# Altium schematic sheet LCA_V2.SchDoc
size 420 x 297 mm; SheetNumber: 1; SheetTotal: 3
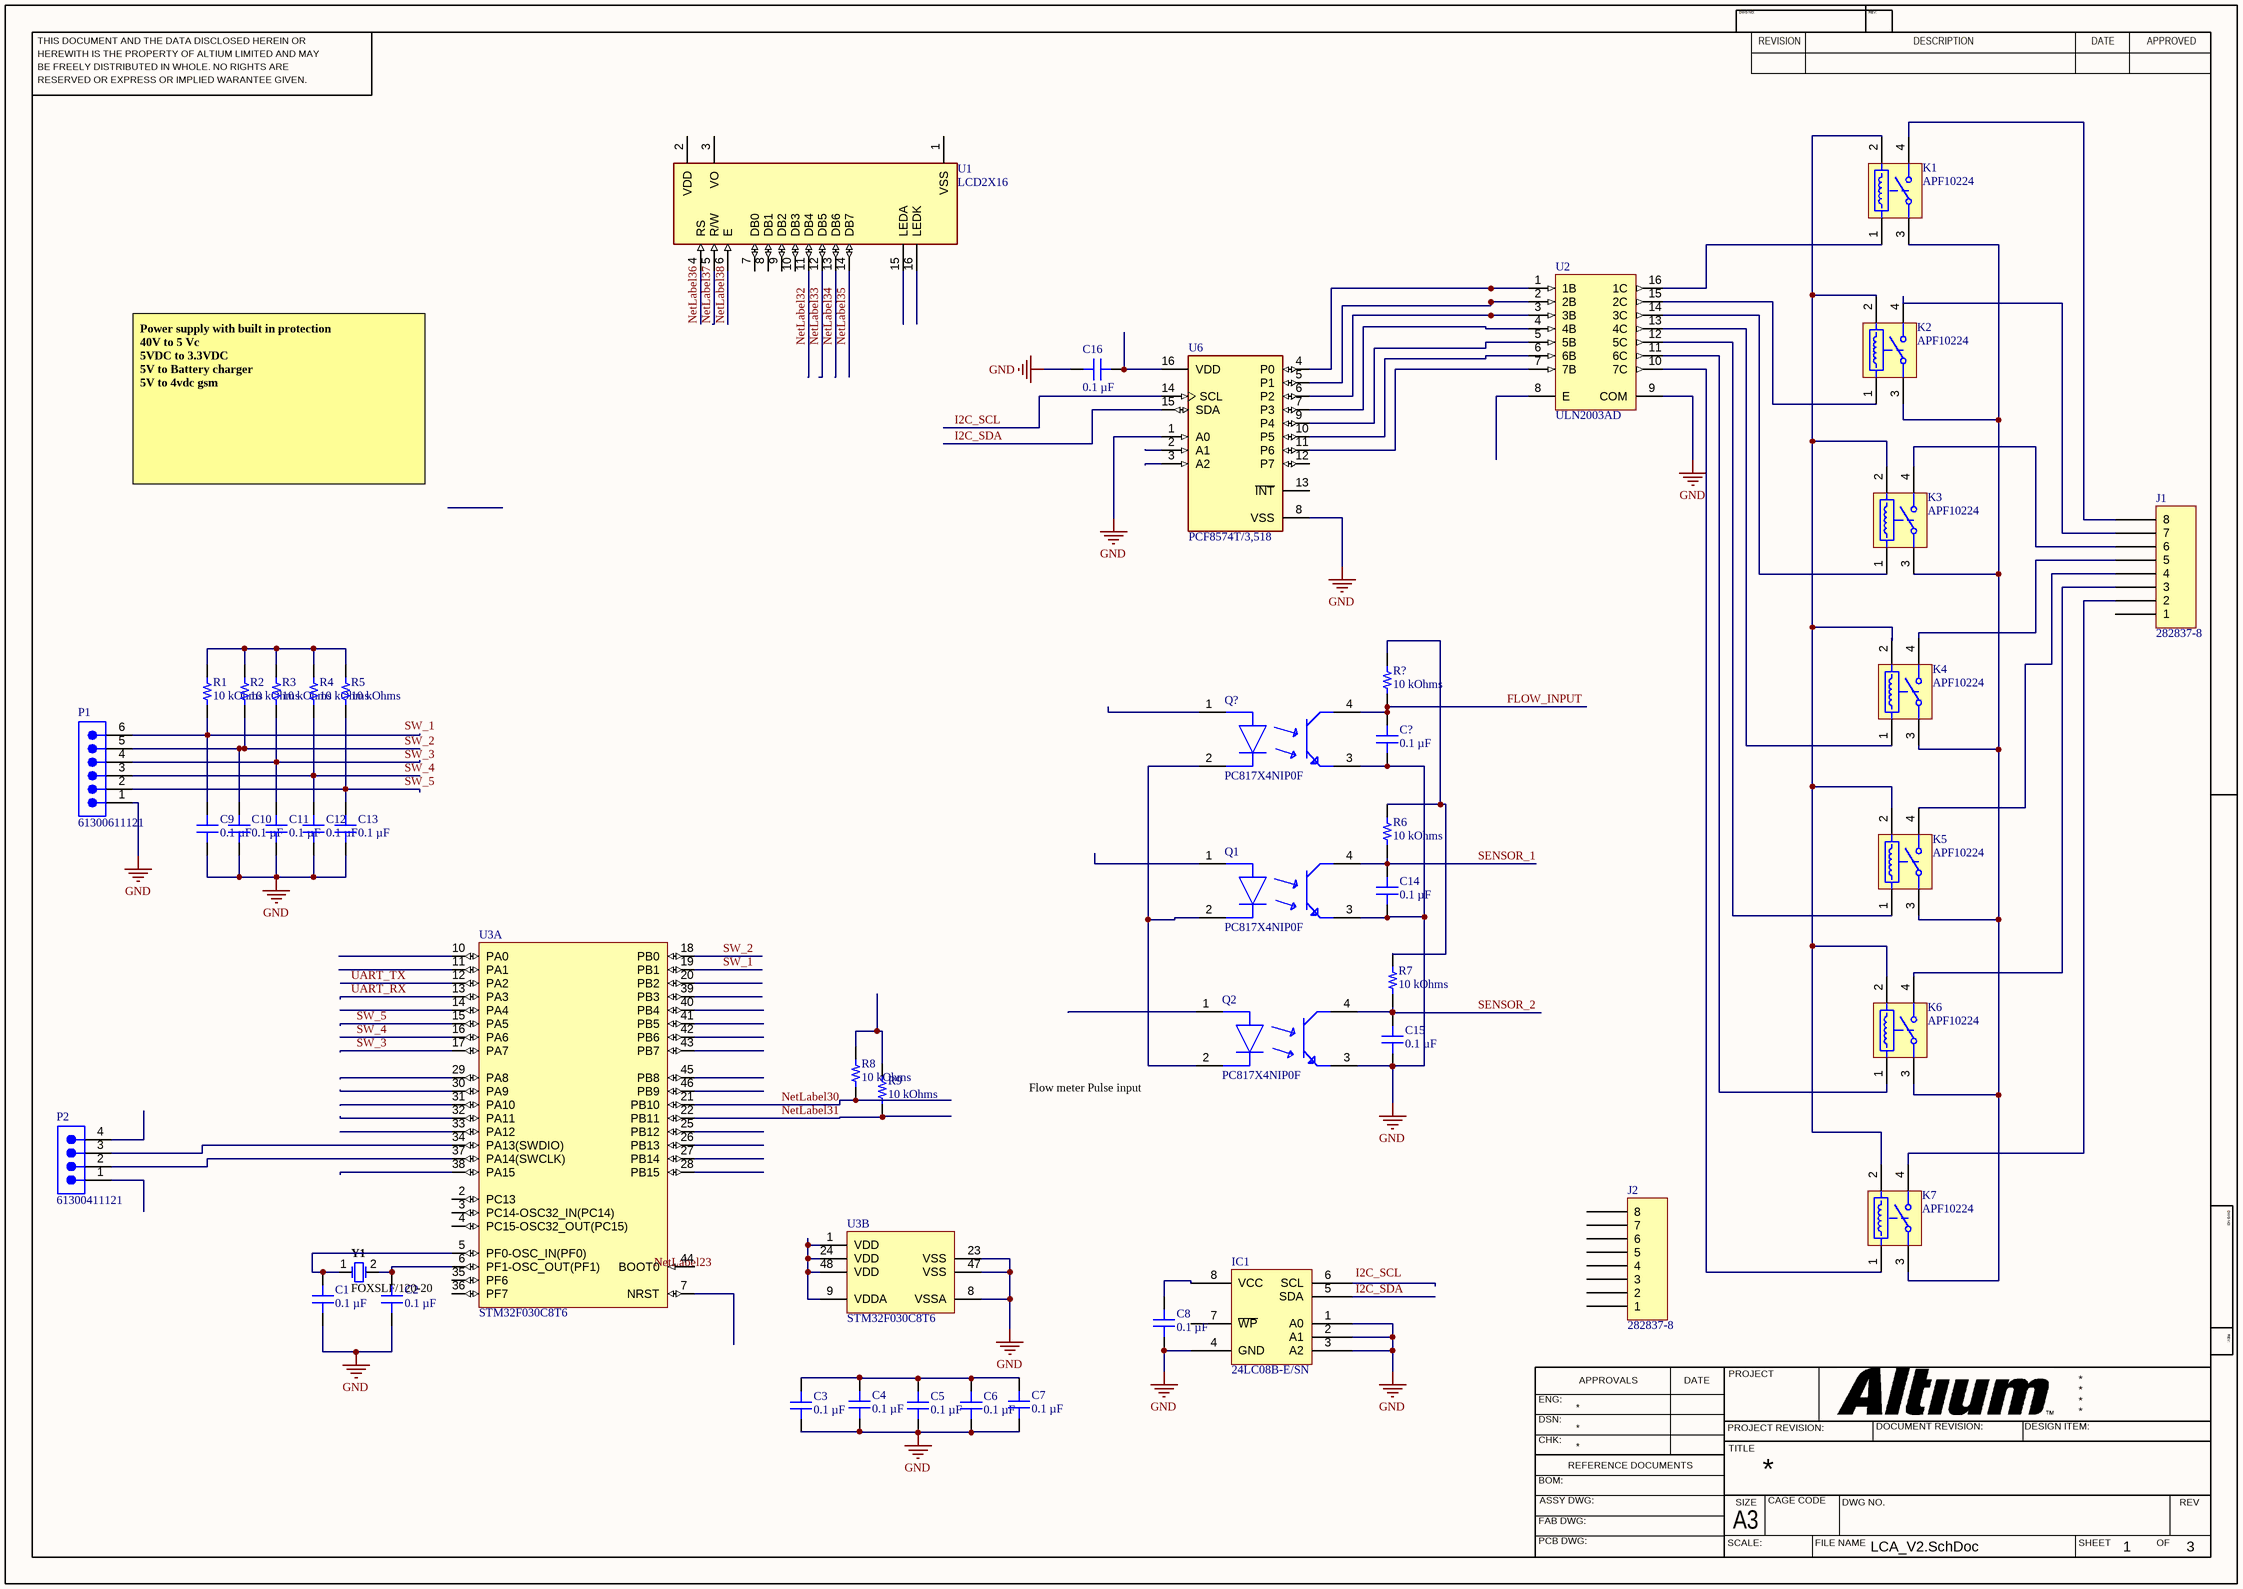
[diagram p0: LCA_V2.SchDoc]

## Parts
C1  0.1 µF  [CAP 0603_1608]
C2  0.1 µF  [CAP 0603_1608]
C3  0.1 µF  [CAP 0603_1608]
C4  0.1 µF  [CAP 0603_1608]
C5  0.1 µF  [CAP 0603_1608]
C6  0.1 µF  [CAP 0603_1608]
C7  0.1 µF  [CAP 0603_1608]
C8  0.1 µF  [CAP 0603_1608]
C9  0.1 µF  [CAP 0603_1608]
C10  0.1 µF  [CAP 0603_1608]
C11  0.1 µF  [CAP 0603_1608]
C12  0.1 µF  [CAP 0603_1608]
C13  0.1 µF  [CAP 0603_1608]
C14  0.1 µF  [CAP 0603_1608]
C15  0.1 µF  [CAP 0603_1608]
C16  0.1 µF  [CAP 0603_1608]
C?  0.1 µF  [CAP 0603_1608]
IC1  24LC08B-E/SN  [MICROCHIP SOIC-8 150MIL WIDE]
J1  282837-8  [TE 282837-8]
J2  282837-8  [TE 282837-8]
K1  APF10224  [PNSC-PF-4-2800x500x1500_V]
K2  APF10224  [PNSC-PF-4-2800x500x1500_V]
K3  APF10224  [PNSC-PF-4-2800x500x1500_V]
K4  APF10224  [PNSC-PF-4-2800x500x1500_V]
K5  APF10224  [PNSC-PF-4-2800x500x1500_V]
K6  APF10224  [PNSC-PF-4-2800x500x1500_V]
K7  APF10224  [PNSC-PF-4-2800x500x1500_V]
P1  61300611121  [61300611121]
P2  61300411121  [61300411121]
Q1  PC817X4NIP0F  [FP-PC817X4NIP0F-MFG]
Q2  PC817X4NIP0F  [FP-PC817X4NIP0F-MFG]
Q?  PC817X4NIP0F  [FP-PC817X4NIP0F-MFG]
R1  10 kOhms  [RES 0603_1608]
R2  10 kOhms  [RES 0603_1608]
R3  10 kOhms  [RES 0603_1608]
R4  10 kOhms  [RES 0603_1608]
R5  10 kOhms  [RES 0603_1608]
R6  10 kOhms  [RES 0603_1608]
R7  10 kOhms  [RES 0603_1608]
R8  10 kOhms  [RES 0603_1608]
R9  10 kOhms  [RES 0603_1608]
R?  10 kOhms  [RES 0603_1608]
U1  LCD2X16  [LCD_LCD2X16]
U2  ULN2003AD  [D0016A_M]
U3  STM32F030C8T6  [STM-LQFP48_L]  (parts A,B of 2)
U6  PCF8574T/3,518  [FP-SOT162-1-MFG]
Y1  FOXSLF/120-20  [FOX-FOXSLF-2_V]

## Nets
GND: C1.1 C2.1 C3.1 C4.1 C5.1 C6.1 C7.1 C8.1 C9.1 C10.1 C11.1 C12.1 C13.1 C14.1 C15.1 C16.2 C?.1 IC1.1(A0) IC1.2(A1) IC1.3(A2) IC1.4(GND) P1.1 Q1.3(E) Q2.3(E) Q?.3(E) U2.9(COM) U3.8(VSSA) U3.23(VSS) U3.47(VSS) U6.1(A0) U6.8(VSS)
FLOW_INPUT: C?.2 Q?.4(C) R?.1
I2C_SCL: U6.14(SCL)
I2C_SDA: IC1.5(SDA) U6.15(SDA)
NetLabel30: R8.1 U3.21(PB10)
NetLabel31: R9.1 U3.22(PB11)
NetLabel32: U1.11(DB4)
NetLabel33: U1.12(DB5)
NetLabel34: U1.13(DB6)
NetLabel35: U1.14(DB7)
NetLabel36: U1.4(RS)
NetLabel37: U1.5(R/W)
NetLabel38: U1.6(E)
SENSOR_1: C14.2 Q1.4(C) R6.1
SENSOR_2: C15.2 Q2.4(C) R7.1
SW_1: U3.19(PB1)
SW_2: C10.2 P1.5 R2.1 U3.18(PB0)
SW_3: C11.2 P1.4 R3.1 U3.17(PA7)
SW_4: C12.2 P1.3 R4.1 U3.16(PA6)
SW_5: C13.2 P1.2 R5.1 U3.15(PA5)
UART_RX: U3.13(PA3)
UART_TX: U3.12(PA2)
NetC1_2: C1.2 U3.5(PF0-OSC_IN(PF0)) Y1.1
NetC2_2: C2.2 U3.6(PF1-OSC_OUT(PF1)) Y1.2
NetC3_2: C3.2 C4.2 C5.2 C6.2 C7.2
NetC8_2: C8.2 IC1.8(VCC)
NetC9_2: C9.2 P1.6 R1.1
NetC16_1: C16.1 U6.16(VDD)
NetJ1_2: J1.2 K7.4(NO)
NetJ1_3: J1.3 K6.4(NO)
NetJ1_4: J1.4 K5.4(NO)
NetJ1_5: J1.5 K4.4(NO)
NetJ1_6: J1.6 K3.4(NO)
NetJ1_7: J1.7 K2.4(NO)
NetJ1_8: J1.8 K1.4(NO)
NetK1_1: K1.1 U2.16(1C)
NetK1_2: K1.2 K2.2 K3.2 K4.2 K5.2 K6.2 K7.2
NetK1_3: K1.3(COM) K2.3(COM) K3.3(COM) K4.3(COM) K5.3(COM) K6.3(COM) K7.3(COM)
NetK2_1: K2.1 U2.15(2C)
NetK3_1: K3.1 U2.14(3C)
NetK4_1: K4.1 U2.13(4C)
NetK5_1: K5.1 U2.12(5C)
NetK6_1: K6.1 U2.11(6C)
NetK7_1: K7.1 U2.10(7C)
NetP2_2: P2.2 U3.37(PA14(SWCLK))
NetP2_3: P2.3 U3.34(PA13(SWDIO))
NetQ1_2: Q1.2(C) Q2.2(C) Q?.2(C)
NetR1_2: R1.2 R2.2 R3.2 R4.2 R5.2
NetR6_2: R6.2 R7.2 R?.2
NetR8_2: R8.2 R9.2
NetU2_1: U2.1(1B) U6.4(P0)
NetU2_2: U2.2(2B) U6.5(P1)
NetU2_3: U2.3(3B) U6.6(P2)
NetU2_4: U2.4(4B) U6.7(P3)
NetU2_5: U2.5(5B) U6.9(P4)
NetU2_6: U2.6(6B) U6.10(P5)
NetU2_7: U2.7(7B) U6.11(P6)
NetU3_1: U3.1(VDD) U3.9(VDDA) U3.24(VDD) U3.48(VDD)

Not connected (* = marked no-connect by the designer): IC1 6(SCL) 7(~{WP}); J1 1; J2 1 2 3 4 5 6 7 8; P2 1 4; Q1 1(A); Q2 1(A); Q? 1(A); U1 1(VSS) 2(VDD) 3(VO) 7(DB0) 8(DB1) 9(DB2) 10(DB3) 15(LEDA) 16(LEDK); U2 8(E); U3 2(PC13) 3(PC14-OSC32_IN(PC14)) 4(PC15-OSC32_OUT(PC15)) 7(NRST) 10(PA0) 11(PA1) 14(PA4) 20(PB2) 25(PB12) 26(PB13) 27(PB14) 28(PB15) 29(PA8) 30(PA9) 31(PA10) 32(PA11) 33(PA12) 35(PF6) 36(PF7) 38(PA15) 39(PB3) 40(PB4) 41(PB5) 42(PB6) 43(PB7) 44(BOOT0) 45(PB8) 46(PB9); U6 2(A1) 3(A2) 12(P7) 13(~{INT})

## Notes on the sheet
- Power supply with built in protection
  40V to 5 Vc
  5VDC to 3.3VDC
  5V to Battery charger
  5V to 4vdc gsm
- (near Q2) Flow meter Pulse input
- Labels drawn without touching a wire or pin: I2C_SCL, NetLabel23, SW_1
- THIS DOCUMENT AND THE DATA DISCLOSED HEREIN OR
- HEREWITH IS THE PROPERTY OF ALTIUM LIMITED AND MAY
- DWG NO:
- REVISION
- REV:
- DESCRIPTION
- DATE
- APPROVED
- BE FREELY DISTRIBUTED IN WHOLE. NO RIGHTS ARE
- RESERVED OR EXPRESS OR IMPLIED WARANTEE GIVEN.
- ENG:
- APPROVALS
- PROJECT
- DSN:
- CHK:
- REFERENCE DOCUMENTS
- PROJECT REVISION:
- TITLE
- DOCUMENT REVISION:
- DESIGN ITEM:
- BOM:
- FAB DWG:
- PCB DWG:
- ASSY DWG:
- SCALE:
- A3
- SIZE
- CAGE CODE
- FILE NAME
- DWG NO.
- SHEET
- OF
- REV

## Library data of the parts
C1-C16 C? = C0603C104K5RAC7411: CAP CER 0.1UF 50V X7R 0603; manufacturer: KEMET; Tolerance: ±10%; Part Number: C0603C104K5RAC7411; Value: 0.1 µF; Applications: Bypass, Decoupling; Capacitance: 0.1 µF; componentlink1description: Datasheet; componentlink1url: https://api.kemet.com/component-edge/download/datasheet/C0603C104K5RAC7411.pdf; componentlink2description: DigiKey Link; componentlink2url: https://www.digikey.com/en/products/detail/kemet/C0603C104K5RAC7411/3317013; Device Package: 0603 (1608 Metric); lastupdated: 22-01-2024 20:10:23; Lifecycle Status: Active; Minimum Order: 1; Mounting Type: Surface Mount, MLCC; Operating Temperature: -55°C ~ 125°C; Package / Case: 0603 (1608 Metric); packaging: TapeAndReel; partid: 2233; Part Status: Active; price: 0.01; series: SMD Comm X7R; Size / Dimension: 0.063" L x 0.031" W (1.60mm x 0.80mm); Supplier 1: DigiKey; Supplier Part Number 1: 399-C0603C104K5RAC7411CT-ND; Temperature Coefficient: X7R; Thickness (Max): 0.035" (0.90mm); Voltage - Rated: 50V
IC1 = 24LC08B-E/SN: IC EEPROM 8KBIT I2C 400KHZ 8SOIC; Manufacturer: Microchip Technology; Access Time: 900 ns; Memory Interface: I²C; Memory Size: 8Kb (256 x 8 x 4); Memory Type: Non-Volatile; Voltage - Supply: 2.5V ~ 5.5V; Write Cycle Time - Word, Page: 5ms; Part Number: 24LC08B-E/SN; Clock Frequency: 400 kHz; ComponentLink1Description: Datasheet; ComponentLink1URL: http://www.microchip.com/mymicrochip/filehandler.aspx?ddocname=en011847; ComponentLink2Description: DigiKey Link; ComponentLink2URL: https://www.digikey.com/en/products/detail/microchip-technology/24LC08B-E-SN/443633; LastUpdated: 06-02-2024 21:35:51; Lifecycle Status: Active; Memory Format: EEPROM; Minimum Order: 1; Mounting Type: Surface Mount; Operating Temperature: -40°C ~ 125°C (TA); Package / Case: 8-SOIC (0.154", 3.90mm Width); Packaging: Tube; PartId: 971; Part Status: Active; Price: 0.42; Series: -; Supplier 1: DigiKey; Supplier Part Number 1: 24LC08B-E/SN-ND; Supplier Device Package: 8-SOIC; Technology: EEPROM
J1 J2 = 282837-8: TERM BLK 8P SIDE ENT 5.08MM PCB; Manufacturer: TE Connectivity AMP Connectors; Current: 13.5 A; Mating Orientation: Horizontal with Board; Number of Levels: 1; Pitch: 0.200" (5.08mm); Positions Per Level: 8; Voltage: 300 V; Wire Gauge: 16-28 AWG; Wire Termination: Screw - Rising Cage Clamp; Part Number: 282837-8; Color: Green; ComponentLink1Description: Datasheet; ComponentLink1URL: https://www.te.com/commerce/DocumentDelivery/DDEController?Action=srchrtrv&DocNm=282837&DocType=Customer+Drawing&DocLang=English; ComponentLink2Description: DigiKey Link; ComponentLink2URL: https://www.digikey.com/en/products/detail/te-connectivity-amp-connectors/282837-8/2222331; Features: Interlocking (Side); LastUpdated: 21-06-2022 15:01:52; Lifecycle Status: Active; Minimum Order: 1; Mounting Type: Through Hole; Packaging: Bulk; Part Status: Active; Price: 1.64; Series: Buchanan; Supplier 1: DigiKey; Supplier Part Number 1: 282837-8-ND
K1-K7 = CMP-1503-00268-1: PF Relays, 24 V Coil Voltage, 170 mW Nominal Operating Power, -40 to 85 degC, 4-Pin PF, Tube, Case, RoHS; Manufacturer: Panasonic; Pb-Free: True; Mechanical Life(Min.operation): 5x10^6; Max Switching Current: 6 A; Nominal Operating Power: 170 mW; Max Switching Voltage: 250 V AC; Coil Voltage: 24 V; Electrical Life: 5x10^4; ComponentLink2Description: Datasheet; RoHS: True; ComponentLink1URL: http://www3.panasonic.biz/ac/ae/index.jsp; Mounting Technology: Through Hole; ComponentLink2URL: http://www3.panasonic.biz/ac/e_download/control/relay/power/catalog/mech_eng_pf.pdf?f_cd=300412; ComponentLink3URL: http://www3.panasonic.biz/ac/e_download/control/relay/power/catalog/mech_eng_pf.pdf?f_cd=300412; Series: PF Relays; PartNumber: APF10224; ComponentLink3Description: Package Specification; ComponentLink1Description: Manufacturer URL; Packing: Tube, Case; PackageReference: PF-4-2800x500x1500; PackageVersion: ASCTB205E, 02/2014; PackageDescription: 4-Pin Through Hole Terminal Package, Body 28 x 5 mm; DatasheetVersion: 201402-T
P1 = CMP-1502-01070-2: NexarPartId: 20084590; Operating Supply Voltage: 250V; Current Rating: 3A; Number of Contacts: 6; Gender: Male; Connector Type: Male Pin; Pitch: 2.54mm; Contact Resistance: 20mΩ; Lead Free: Lead Free; REACH SVHC: Unknown; Number of Rows: 1; Color: Black; Min Operating Temperature: -40°C; Contact Material: Copper; Lead Pitch: 2.54mm; Contact Plating: Gold; Number of Pins: 6; Height: 8.89mm; Orientation: Vertical; Termination: Through Hole; Mount: Through Hole; RoHS: Compliant; Contact Gender: Male; Contact Mating Length: 5.9944mm; Voltage Rating: 250V; Number of Positions: 6; Housing Material: PBT; Packaging: Bulk; Max Operating Temperature: 105°C
P2 = CMP-1502-01064-2: NexarPartId: 32855522; Pitch: 2.54mm; Number of Contacts: 4; Contact Resistance: 20mΩ; Gender: Male; Current Rating: 3A; Connector Type: Male Pin; Voltage Rating: 250V; Lead Free: Lead Free; Contact Plating: Gold; Max Operating Temperature: 105°C; Packaging: Bulk; Height: 8.89mm; Orientation: Vertical; Contact Mating Length: 5.9944mm; Contact Material: Copper; Lead Pitch: 2.54mm; Min Operating Temperature: -40°C; Termination: Solder; Color: Black; Number of Rows: 1; REACH SVHC: Unknown; RoHS: Compliant; Mount: Through Hole; Number of Positions: 4; Number of Pins: 4; Operating Supply Voltage: 250V
Q1 Q2 Q? = CMP-65434-000001-1: OPTOISOLATOR 5KV TRANS 4SMD; Manufacturer: Sharp; Collector Emitter Voltage: 80V; Standoff Height: 0.1mm; Power Dissipation: 200mW; Min Current Transfer Ratio: 50%; Reverse Voltage: 6V; Forward Current: 20mA; Forward Voltage: 1.2V; Max Current Transfer Ratio: 600%; Isolation Voltage: 5kVrms; Mouser Description: Transistor Output Optocouplers Photocoupler 300-600% CRT; RoHS: TRUE; ComponentLink2URL: https://www.sharpsde.com/fileadmin/products/Optoelectronics/Isolation%20Devices/Specs%20Photocoupler/PC817XxNIP0F_17Jun08_Spec_ED-04P129A.pdf; Lead Free: Yes; Device Class L1: Optoelectronics; ComponentLink2Description: Datasheet; Device Class L2: Optocouplers; Temperature: -30°C to +100°C; Temperature Range Low: -30°C; Automotive: No; Temperature Range High: +100°C; Octopart: https://octopart.com/pc817x4nip0f-sharp-20650453; Height: 4.6mm; Digikey Description: OPTOISOLATOR 5KV TRANS 4SMD; Category: Trans; Device Class L3: unset; Package: PC817X4NIP0F; Manufacturer Part Number: PC817X4NIP0F; Emiiter Collector Voltage: 6V
R1-R9 R? = CPF0603B10KE: RES SMD 10K OHM 0.1% 1/16W 0603; Manufacturer: TE Connectivity Passive Product; Power (Watts): 0.063W, 1/16W; Temperature Coefficient: ±25ppm/°C; Part Number: CPF0603B10KE; Value: 10 kOhms; ComponentLink1Description: Datasheet; ComponentLink1URL: https://www.te.com/commerce/DocumentDelivery/DDEController?Action=srchrtrv&DocNm=1773200&DocType=DS&DocLang=English; ComponentLink2Description: DigiKey Link; ComponentLink2URL: https://www.digikey.com/en/products/detail/te-connectivity-passive-product/CPF0603B10KE/2389826; Composition: Thin Film; Device Package: 0603 (1608 Metric); Height - Seated (Max): 0.022" (0.55mm); LastUpdated: 06-02-2024 20:40:31; Lifecycle Status: Active; Minimum Order: 1; Number of Terminations: 2; Operating Temperature: -55°C ~ 155°C; Package / Case: 0603 (1608 Metric); Packaging: TapeAndReel; PartId: 4872; Part Status: Active; Price: 0.09; Resistance: 10 kOhms; Series: CPF, Neohm; Size / Dimension: 0.061" L x 0.031" W (1.55mm x 0.80mm); Supplier 1: DigiKey; Supplier Part Number 1: A119886CT-ND; Supplier Device Package: 0603; Tolerance: ±0.1%
U1 = LCD2X16: Display; Display: LCD 2x16 characters (blue backlight); Price: None; Value: *; MP: LCD2X16; Package: None; Availability: Unavailable
U2 = CMP-2000-04952-1: High-Voltage, High-Current Darlington Transistor Array, 0.5 A, 50 V, -20 to 70 degC, 16-Pin SOIC (D16), Green (RoHS & no Sb/Br), Tube; Manufacturer: TexasInstruments; Package Version: 4040047-6/M, 06/2011; Maximum Collector Emitter Voltage: 50V; Peak DC Collector Current: 0.5A; Maximum Collector Emitter Saturation Voltage: 1.1@100mA; Configuration: Array7; Category: DarlingtonBJT; Type: NPN; Manufacturer URL: http://www.ti.com/; Package: 16SOIC; Package Description: 16-Pin Plastic Small Outline, Body 9.9 x 3.9 mm, Pitch 1.27 mm; Mounting: SurfaceMount; Package URL: http://www.ti.com/lit/ml/mpds178g/mpds178g.pdf; Packaging: Rail/Tube; Datasheet Version: Rev. O, 01/2016; Datasheet URL: http://www.ti.com/general/docs/lit/getliterature.tsp?genericPartNumber=uln2003a&fileType=pdf; Package Reference: D16
U3 = CMP-0304-00024-2: ARM Cortex-M0 32-bit MCU, 64 KB Flash, 8 KB Internal RAM, 39 I/Os, 48-pin LQFP, -40 to 85 degC, Tray; FLASH Size (Prog) (kB): 64; I/Os (High Current): 39; Operating Frequency(F) (Processor speed) (MHz): 48; Supply Voltage(Vcc) min (V): 2.4; Internal RAM Size (kB): 8; Packing: Tray; ComponentLink2URL: http://www.st.com/st-web-ui/static/active/en/resource/technical/document/datasheet/DM00088500.pdf; PackageVersion: Rev. 6, 06/2013; ComponentLink2Description: Datasheet; PartNumber: STM32F030C8T6; PackageDescription: 48-Pin Low Profile Quad Flat Package, 7 x 7 mm Body, 0.5 mm Pitch; Mounting Technology: Surface Mount; ComponentLink1URL: http://www.st.com/web/en/home.html; PackageReference: LQFP48; ComponentLink3URL: http://www.st.com/st-web-ui/static/active/en/resource/technical/document/datasheet/DM00058181.pdf; DatasheetVersion: Rev. 1; Core: ARM Cortex-M0; ComponentLink1Description: Manufacturer URL; ComponentLink3Description: Package Specification
U6 = CMP-10112-000010-1: IC I/O EXPANDER I2C 8B 16SOIC; Manufacturer: NXP Semiconductors; Frequency: 100kHz; Max Supply Voltage: 6V; Standoff Height: 0.1mm; Nominal Supply Current: 40uA; Max Junction Temp: +125°C; Min Supply Voltage: 2.5V; Number Of I/Os: 8; Manufacturer Part Number: PCF8574T/3,518; Footprint Url: https://www.nxp.com/docs/en/package-information/SOT162-1.pdf; ComponentLink2URL: https://www.nxp.com/docs/en/data-sheet/PCF8574_PCF8574A.pdf; Automotive: No; Digikey Description: IC I/O EXPANDER I2C 8B 16SOIC; Mouser Description: PCF8574 Series 2.5 - 6V Remote 8-bit I/O Expander for I2C-bus - SOIC-16; Ipc Land Pattern Name: SOIC127P1032X265-16; Interface: I2C; Octopart: https://octopart.com/pcf8574t%2F3%2C518-nxp+semiconductors-10470852; Ambient Temperature Range Low: -40°C; Lead Free: Yes; Device Class L2: Interface ICs; Temperature Range High: +85°C; Device Class L1: Integrated Circuits (ICs); Package: SOT162-1; ComponentLink2Description: Datasheet; Device Class L3: I/O Expanders; Temperature: -40°C to +85°C; Ambient Temperature Range High: +85°C; Height: 2.65mm; Category: IC; RoHS: TRUE; Temperature Range Low: -40°C
Y1 = CMP-1749-00004-1: Resistance Weld Thru-Hole Crystal, 12 MHz, +/-30 ppm, -20 to 70 degC, 2-Pin THD, RoHS, Bulk; Elements: 1; Rds On Max: 115 mohm; Typical Rise Time: 90 ns; Max Power Dissipation: 2.5 W; Case\Package: TO-251-3; Input Capacitance: 350 pF; REACH SVHC: No SVHC; Length: 6.6 mm; ComponentLink1URL: http://www.foxonline.com/; PackageDescription: 2-Pin Through Hole Device, Body 11.35 x 4.65 mm, Pitch 4.88 mm; Radiation Hardening: No; Package Quantity: 70; Packaging: Rail/Tube; ComponentLink1Description: Manufacturer URL; Min Operating Temperature: -55 degC; Max Operating Temperature: 150 degC; RoHSCompliant: true; PackageReference: FOXSLF-2; DatasheetVersion: Mar-15; Pins: 3; Height: 6.1 mm; Mount: Through Hole; ComponentLink2URL: http://www.foxonline.com/pdfs/hc49slf.pdf; ComponentLink2Description: Datasheet; Width: 2.3 mm